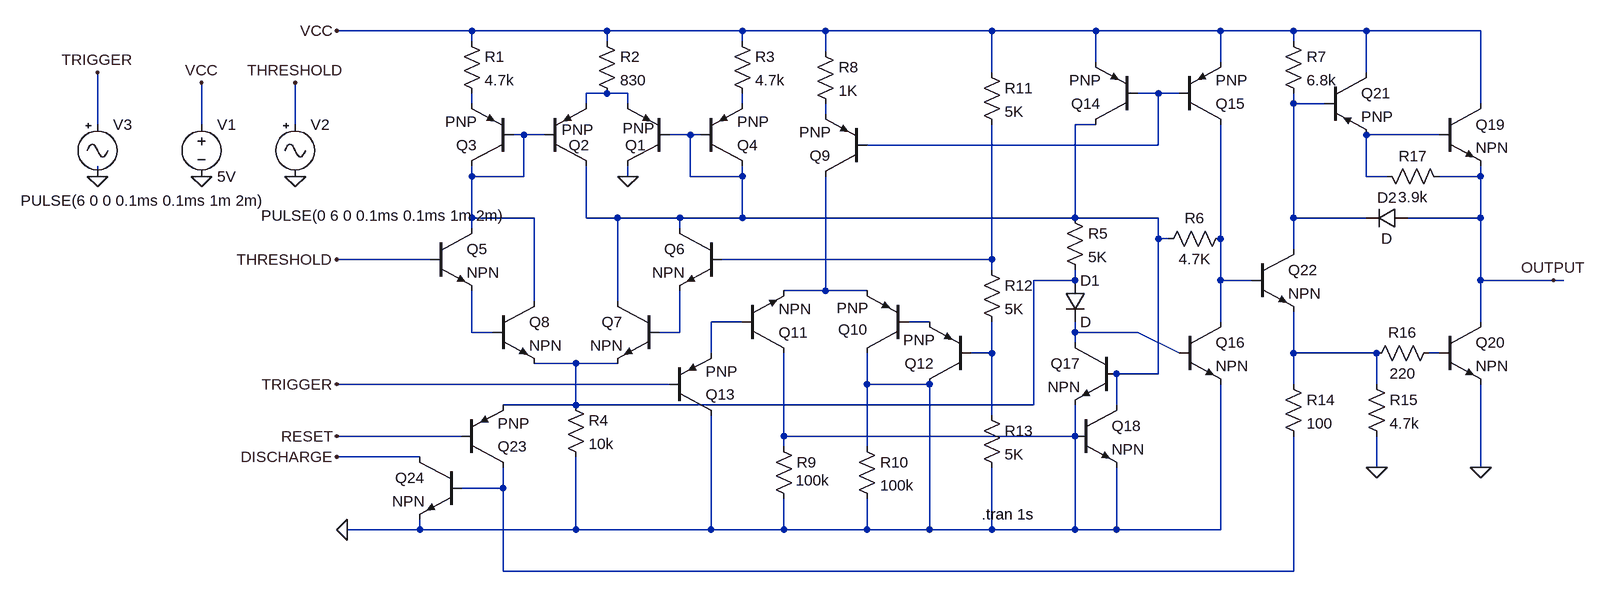
[diagram p0: schematic 555timer.asc]
555timer.asc, the LTspice schematic file:
Version 4
SHEET 1 3264 3032
WIRE 960 2160 752 2160
WIRE 1168 2160 960 2160
WIRE 1376 2160 1168 2160
WIRE 1504 2160 1376 2160
WIRE 1760 2160 1504 2160
WIRE 1920 2160 1760 2160
WIRE 2112 2160 1920 2160
WIRE 2224 2160 2112 2160
WIRE 2336 2160 2224 2160
WIRE 2512 2160 2336 2160
WIRE 960 2176 960 2160
WIRE 1168 2176 1168 2160
WIRE 1376 2176 1376 2160
WIRE 2224 2176 2224 2160
WIRE 1504 2192 1504 2160
WIRE 1920 2208 1920 2160
WIRE 2112 2208 2112 2160
WIRE 1760 2224 1760 2160
WIRE 2336 2224 2336 2160
WIRE 1168 2256 1136 2256
WIRE 1200 2256 1168 2256
WIRE 2016 2256 1984 2256
WIRE 2048 2256 2016 2256
WIRE 960 2272 960 2256
WIRE 1136 2272 1136 2256
WIRE 1200 2272 1200 2256
WIRE 1376 2272 1376 2256
WIRE 2224 2272 2224 2256
WIRE 2272 2272 2224 2272
WIRE 2512 2272 2512 2160
WIRE 1504 2288 1504 2272
WIRE 384 2304 384 2224
WIRE 544 2304 544 2240
WIRE 688 2304 688 2240
WIRE 1920 2304 1888 2304
WIRE 1040 2320 1024 2320
WIRE 1072 2320 1040 2320
WIRE 1296 2320 1264 2320
WIRE 1312 2320 1296 2320
WIRE 2448 2320 2336 2320
WIRE 2016 2336 2016 2256
WIRE 2016 2336 1568 2336
WIRE 384 2384 384 2368
WIRE 960 2384 960 2368
WIRE 1040 2384 1040 2320
WIRE 1040 2384 960 2384
WIRE 1200 2384 1200 2368
WIRE 1296 2384 1296 2320
WIRE 1376 2384 1376 2368
WIRE 1376 2384 1296 2384
WIRE 2336 2384 2336 2320
WIRE 2368 2384 2336 2384
WIRE 2512 2384 2512 2368
WIRE 2512 2384 2448 2384
WIRE 960 2448 960 2384
WIRE 1056 2448 960 2448
WIRE 1136 2448 1136 2368
WIRE 1184 2448 1136 2448
WIRE 1280 2448 1184 2448
WIRE 1376 2448 1376 2384
WIRE 1376 2448 1280 2448
WIRE 1888 2448 1888 2304
WIRE 1888 2448 1376 2448
WIRE 2016 2448 1888 2448
WIRE 2224 2448 2224 2272
WIRE 2336 2448 2224 2448
WIRE 2512 2448 2512 2384
WIRE 2512 2448 2400 2448
WIRE 960 2464 960 2448
WIRE 1280 2464 1280 2448
WIRE 2016 2480 2016 2448
WIRE 2032 2480 2016 2480
WIRE 2112 2480 2112 2304
WIRE 2224 2496 2224 2448
WIRE 896 2512 752 2512
WIRE 1760 2512 1760 2304
WIRE 1760 2512 1344 2512
WIRE 1760 2528 1760 2512
WIRE 1888 2544 1888 2528
WIRE 1888 2544 1824 2544
WIRE 2112 2544 2112 2480
WIRE 2160 2544 2112 2544
WIRE 2512 2544 2512 2448
WIRE 2624 2544 2512 2544
WIRE 2640 2544 2624 2544
WIRE 1504 2560 1504 2384
WIRE 1504 2560 1440 2560
WIRE 1568 2560 1504 2560
WIRE 1056 2576 1056 2448
WIRE 1184 2576 1184 2448
WIRE 1376 2608 1328 2608
WIRE 1664 2608 1632 2608
WIRE 2112 2608 2112 2544
WIRE 2512 2608 2512 2544
WIRE 960 2624 960 2560
WIRE 992 2624 960 2624
WIRE 1280 2624 1280 2560
WIRE 1280 2624 1248 2624
WIRE 1888 2624 1888 2608
WIRE 1984 2624 1888 2624
WIRE 1888 2640 1888 2624
WIRE 1328 2656 1328 2608
WIRE 1760 2656 1760 2608
WIRE 1760 2656 1728 2656
WIRE 2048 2656 1984 2624
WIRE 2224 2656 2224 2592
WIRE 2352 2656 2224 2656
WIRE 2448 2656 2432 2656
WIRE 1120 2672 1056 2672
WIRE 1184 2672 1120 2672
WIRE 2016 2688 2016 2480
WIRE 2016 2688 1952 2688
WIRE 1264 2704 752 2704
WIRE 1568 2704 1568 2656
WIRE 1664 2704 1568 2704
WIRE 2224 2704 2224 2656
WIRE 2352 2704 2352 2656
WIRE 1120 2736 1120 2672
WIRE 1120 2736 1008 2736
WIRE 1824 2736 1824 2544
WIRE 1824 2736 1120 2736
WIRE 1952 2736 1952 2688
WIRE 1760 2752 1760 2656
WIRE 944 2784 752 2784
WIRE 1440 2784 1440 2656
WIRE 1888 2784 1888 2736
WIRE 1888 2784 1440 2784
WIRE 1440 2800 1440 2784
WIRE 1568 2800 1568 2704
WIRE 880 2816 752 2816
WIRE 2352 2832 2352 2784
WIRE 2512 2832 2512 2704
WIRE 1008 2864 1008 2832
WIRE 1008 2864 944 2864
WIRE 880 2928 880 2912
WIRE 880 2928 768 2928
WIRE 1120 2928 1120 2816
WIRE 1120 2928 880 2928
WIRE 1328 2928 1328 2752
WIRE 1328 2928 1120 2928
WIRE 1440 2928 1440 2880
WIRE 1440 2928 1328 2928
WIRE 1568 2928 1568 2880
WIRE 1568 2928 1440 2928
WIRE 1664 2928 1664 2704
WIRE 1664 2928 1568 2928
WIRE 1760 2928 1760 2832
WIRE 1760 2928 1664 2928
WIRE 1888 2928 1888 2784
WIRE 1888 2928 1760 2928
WIRE 1952 2928 1952 2832
WIRE 1952 2928 1888 2928
WIRE 2112 2928 2112 2704
WIRE 2112 2928 1952 2928
WIRE 1008 2992 1008 2864
WIRE 2224 2992 2224 2784
WIRE 2224 2992 1008 2992
FLAG 1200 2384 0
FLAG 752 2160 VCC
FLAG 752 2512 THRESHOLD
FLAG 768 2928 0
FLAG 544 2240 VCC
FLAG 544 2384 0
FLAG 688 2240 THRESHOLD
FLAG 688 2384 0
FLAG 752 2704 TRIGGER
FLAG 384 2224 TRIGGER
FLAG 2352 2832 0
FLAG 2512 2832 0
FLAG 2624 2544 OUTPUT
FLAG 752 2784 RESET
FLAG 752 2816 DISCHARGE
FLAG 384 2384 0
SYMBOL res 944 2160 R0
SYMATTR InstName R1
SYMATTR Value 4.7k
SYMBOL res 1152 2160 R0
SYMATTR InstName R2
SYMATTR Value 830
SYMBOL res 1360 2160 R0
SYMATTR InstName R3
SYMATTR Value 4.7k
SYMBOL pnp 1072 2368 M180
WINDOW 0 124 32 Left 2
WINDOW 3 120 58 Left 2
SYMATTR InstName Q1
SYMBOL pnp 1264 2368 R180
WINDOW 0 123 32 Left 2
WINDOW 3 117 56 Left 2
SYMATTR InstName Q2
SYMBOL pnp 1024 2368 R180
SYMATTR InstName Q3
SYMBOL pnp 1312 2368 M180
SYMATTR InstName Q4
SYMBOL npn 896 2464 R0
SYMATTR InstName Q5
SYMBOL npn 1344 2464 M0
SYMATTR InstName Q6
SYMBOL npn 1248 2576 M0
SYMATTR InstName Q7
SYMBOL npn 992 2576 R0
SYMATTR InstName Q8
SYMBOL res 1104 2720 R0
SYMATTR InstName R4
SYMATTR Value 10k
SYMBOL voltage 544 2288 R0
SYMATTR InstName V1
SYMATTR Value 5V
SYMBOL Misc\\signal 688 2288 R0
WINDOW 123 0 0 Left 0
WINDOW 39 0 0 Left 0
WINDOW 3 -52 156 Left 2
SYMATTR InstName V2
SYMATTR Value PULSE(0 6 0 0.1ms 0.1ms 1m 2m)
SYMBOL res 1488 2176 R0
SYMATTR InstName R8
SYMATTR Value 1K
SYMBOL pnp 1568 2384 R180
SYMATTR InstName Q9
SYMBOL pnp 1632 2656 R180
WINDOW 0 63 36 Left 2
WINDOW 3 62 69 Left 2
SYMATTR InstName Q10
SYMBOL npn 1376 2656 M180
SYMATTR InstName Q11
SYMBOL pnp 1728 2704 R180
SYMATTR InstName Q12
SYMBOL pnp 1264 2752 M180
SYMATTR InstName Q13
SYMBOL res 1424 2784 R0
WINDOW 3 34 68 Left 2
SYMATTR InstName R9
SYMATTR Value 100k
SYMBOL res 1552 2784 R0
SYMATTR InstName R10
SYMATTR Value 100k
SYMBOL res 1744 2208 R0
SYMATTR InstName R11
SYMATTR Value 5K
SYMBOL res 1744 2512 R0
SYMATTR InstName R12
SYMATTR Value 5K
SYMBOL res 1744 2736 R0
SYMATTR InstName R13
SYMATTR Value 5K
SYMBOL pnp 1984 2304 R180
SYMATTR InstName Q14
SYMBOL pnp 2048 2304 M180
SYMATTR InstName Q15
SYMBOL npn 2048 2608 R0
SYMATTR InstName Q16
SYMBOL npn 1952 2640 M0
SYMATTR InstName Q17
SYMBOL diode 1872 2544 R0
SYMATTR InstName D1
SYMBOL res 1872 2432 R0
SYMATTR InstName R5
SYMATTR Value 5K
SYMBOL res 2128 2464 R90
WINDOW 0 0 56 VBottom 2
WINDOW 3 32 56 VTop 2
SYMATTR InstName R6
SYMATTR Value 4.7K
SYMBOL npn 1888 2736 R0
SYMATTR InstName Q18
SYMBOL npn 2448 2272 R0
SYMATTR InstName Q19
SYMBOL npn 2448 2608 R0
SYMATTR InstName Q20
SYMBOL pnp 2272 2224 R0
SYMATTR InstName Q21
SYMBOL npn 2160 2496 R0
SYMATTR InstName Q22
SYMBOL res 2208 2160 R0
SYMATTR InstName R7
SYMATTR Value 6.8k
SYMBOL res 2208 2688 R0
SYMATTR InstName R14
SYMATTR Value 100
SYMBOL res 2336 2688 R0
SYMATTR InstName R15
SYMATTR Value 4.7k
SYMBOL res 2448 2640 R90
WINDOW 0 0 56 VBottom 2
WINDOW 3 32 56 VTop 2
SYMATTR InstName R16
SYMATTR Value 220
SYMBOL res 2352 2368 M90
WINDOW 0 0 56 VBottom 2
WINDOW 3 32 56 VTop 2
SYMATTR InstName R17
SYMATTR Value 3.9k
SYMBOL diode 2400 2432 R90
WINDOW 0 0 32 VBottom 2
WINDOW 3 32 32 VTop 2
SYMATTR InstName D2
SYMBOL pnp 944 2832 M180
SYMATTR InstName Q23
SYMBOL npn 944 2816 M0
SYMATTR InstName Q24
SYMBOL Misc\\signal 384 2288 R0
WINDOW 3 -118 133 Left 2
WINDOW 123 0 0 Left 0
WINDOW 39 0 0 Left 0
SYMATTR InstName V3
SYMATTR Value PULSE(6 0 0 0.1ms 0.1ms 1m 2m)
TEXT 1744 2904 Left 2 !.tran 1s

The netlist it stands for:
* 555timer.asc
R1 VCC N003 4.7k
R2 VCC N001 830
R3 VCC N004 4.7k
Q1 N007 N008 N001 0 PNP
Q2 0 N007 N001 0 PNP
Q3 N008 N008 N003 0 PNP
Q4 N007 N007 N004 0 PNP
Q5 N008 THRESHOLD N016 0 NPN
Q6 N007 N011 N017 0 NPN
Q7 N007 N017 N012 0 NPN
Q8 N008 N016 N012 0 NPN
R4 N012 0 10k
V1 VCC 0 5V
V2 THRESHOLD 0 PULSE(0 6 0 0.1ms 0.1ms 1m 2m)
R8 VCC N006 1K
Q9 N013 N002 N006 0 PNP
Q10 0 N015 N013 0 PNP
Q11 0 N014 N013 0 NPN
Q12 0 N019 N015 0 PNP
Q13 0 TRIGGER N014 0 PNP
R9 0 0 100k
R10 0 0 100k
R11 VCC N011 5K
R12 N011 N019 5K
R13 N019 0 5K
Q14 N007 N002 VCC 0 PNP
Q15 N010 N002 VCC 0 PNP
Q16 N010 N018 0 0 NPN
Q17 N018 N007 0 0 NPN
D1 N012 N018 D
R5 N007 N012 5K
R6 N010 N007 4.7K
Q18 N007 0 0 0 NPN
Q19 VCC N009 OUTPUT 0 NPN
Q20 OUTPUT N021 0 0 NPN
Q21 VCC N005 N009 0 PNP
Q22 N005 N010 N020 0 NPN
R7 VCC N005 6.8k
R14 N020 N022 100
R15 N020 0 4.7k
R16 N021 N020 220
R17 N009 OUTPUT 3.9k
D2 OUTPUT N005 D
Q23 N022 RESET N012 0 PNP
Q24 DISCHARGE N022 0 0 NPN
V3 TRIGGER 0 PULSE(6 0 0 0.1ms 0.1ms 1m 2m)
.model D D
.lib standard.dio
.model NPN NPN
.model PNP PNP
.lib standard.bjt
.tran 1s
.backanno
.end